# Altium project Advanced Active Tone Control.PrjPcb
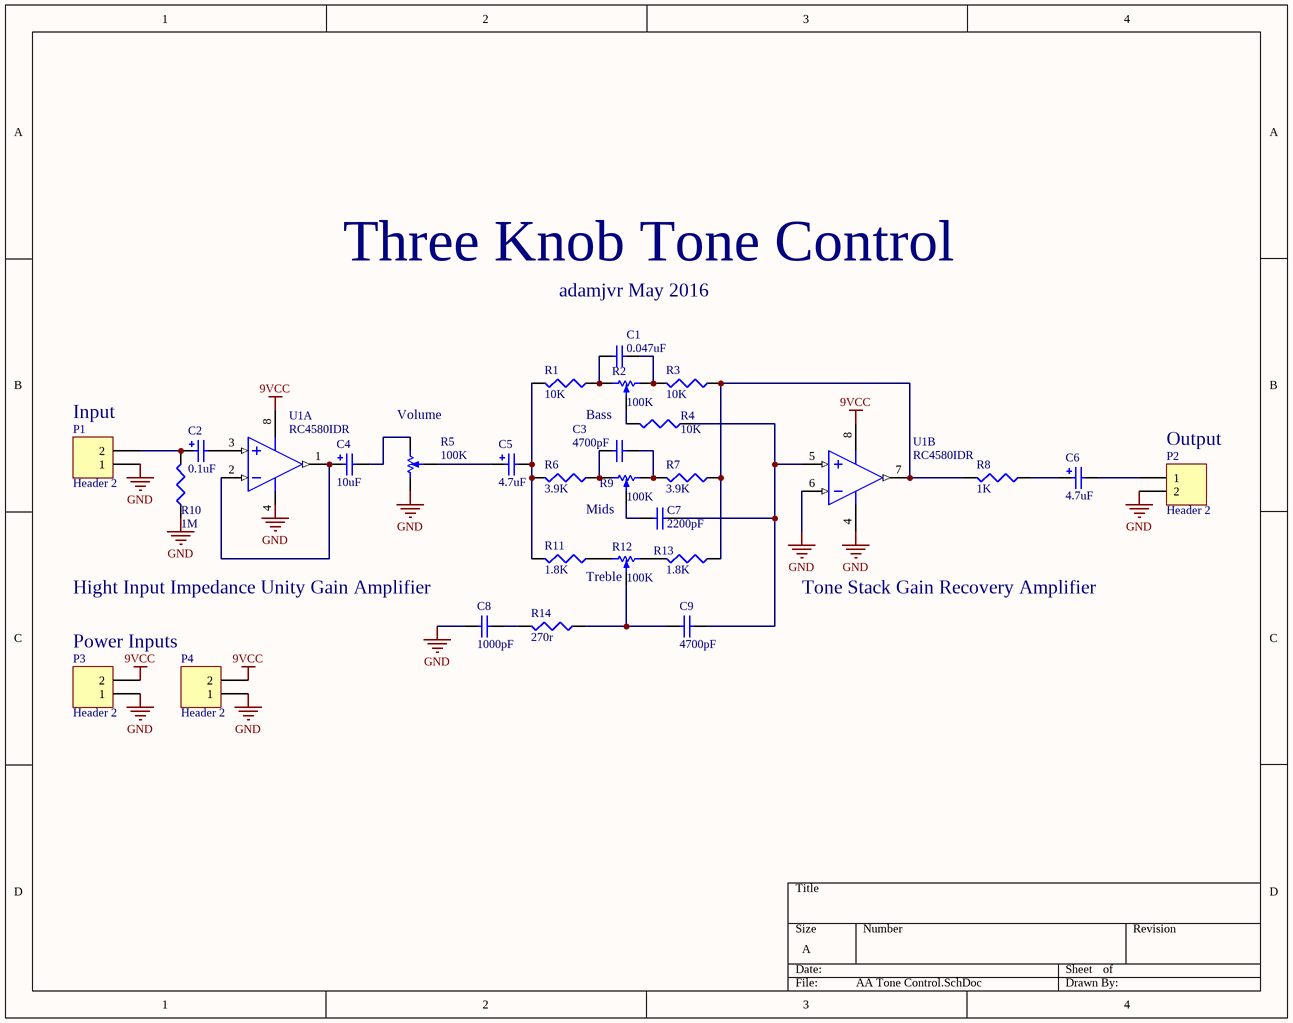
[diagram p0: AA Tone Control.SchDoc]
1 sheet, 28 parts. Net scope: global (net labels, ports and power ports of the same name join across sheets).
Board file: AA Tone Control.PcbDoc

## Sheet AA Tone Control.SchDoc
size A

### Parts
C1  0.047uF  [K473K15X7RF5TH5]
C2  0.1uF  [4X6mmCAP]
C3  4700pF  [VY2472M49Y5US63V7]
C4  10uF  [5X12.5mmCAP - GREEN]
C5  4.7uF  [4X6mmCAP]
C6  4.7uF  [4X6mmCAP]
C7  2200pF  [VY1222M47Y5UQ63V0]
C8  1000pF  [VY2102M29Y5US63V7]
C9  4700pF  [VY2472M49Y5US63V7]
P1  Header 2  [HDR1X2]
P2  Header 2  [HDR1X2]
P3  Header 2  [HDR1X2]
P4  Header 2  [HDR1X2]
R1  10K  [R0805]
R2  100K  [BOURNS_PTD90SERIES_POT]
R3  10K  [R0805]
R4  10K  [R0805]
R5  100K  [BOURNS_PTD90SERIES_POT]
R6  3.9K  [R0805]
R7  3.9K  [R0805]
R8  1K  [R0805]
R9  100K  [BOURNS_PTD90SERIES_POT]
R10  1M  [R0805]
R11  1.8K  [R0805]
R12  100K  [BOURNS_PTD90SERIES_POT]
R13  1.8K  [R0805]
R14  270r  [R0805]
U1  RC4580IDR  [SOIC127P600X175-8N]  (parts A,B of 2)

### Nets
9VCC: P3.2 P4.2 U1.8(V+)
GND: C8.2 P1.1 P2.2 P3.1 P4.1 R5.3 R10.1 U1.4(V-) U1.6(IN_B)
NetC1_1: C1.1 R2.1 R3.2
NetC1_2: C1.2 R1.1 R2.3
NetC2_1: C2.1 P1.2 R10.2
NetC2_2: C2.2 U1.3(IN_A)
NetC3_1: C3.1 R7.2 R9.1
NetC3_2: C3.2 R6.1 R9.3
NetC4_1: C4.1 U1.1(OUT_A) U1.2(IN_A)
NetC4_2: C4.2 R5.1
NetC5_1: C5.1 R5.2
NetC5_2: C5.2 R1.2 R6.2 R11.2
NetC6_1: C6.1 R8.1
NetC6_2: C6.2 P2.1
NetC7_1: C7.1 C9.1 R4.1 U1.5(IN_B)
NetC7_2: C7.2 R9.2
NetC8_1: C8.1 R14.2
NetC9_2: C9.2 R12.2 R14.1
NetR2_2: R2.2 R4.2
NetR3_1: R3.1 R7.1 R8.2 R13.1 U1.7(OUT_B)
NetR11_1: R11.1 R12.3
NetR12_1: R12.1 R13.2

### Notes on the sheet
- Three Knob Tone Control
- adamjvr May 2016
- (near P1) Input
- (near R5) Volume
- (near R2) Bass
- (near P2) Output
- (near R9) Mids
- (near C8) Hight Input Impedance Unity Gain Amplifier
- (near R12) Treble
- Tone Stack Gain Recovery Amplifier
- Power Inputs
- Labels drawn without touching a wire or pin: GND

### Library data of the parts
C1 = K473K15X7RF5TH5: 0.047µF ±10% 50V X7R Ceramic Capacitor -55°C ~ 125°C Through Hole Radial 0.157" L x 0.098" W (4.00mm x 2.50mm); MFR: Vishay BC Components; Pin Count #: 2; Type: Ceramic dipped Capacitor K series 5mm lead spacing; Lead-Free ?: Yes; Designer: Adam Vadala-Roth; MFR #: K473K15X7RF5TH5; Status: Active; Mounting: Through Hole; Datasheet: http://www.vishay.com/docs/45171/kseries.pdf; Height: 6.54mm; Tolerance: 10%; Cost: 0.04692 @ 1000; Voltage: 50V; Date Created: 11 May 2016; Last Modified: 11 May 2016; Value: 0.047uF
C2 = UMW1H0R1MDD1TP: CAP ALUM 0.1UF 20% 50V RADIAL; MFR: Nichion; Pin Count #: 2; Type: Aluminum Capacitor; Lead-Free ?: Yes; Designer: Adam Vadala-Roth; MFR #: UMW1H0R1MDD1TP; Status: Active; Mounting: Through Hole; Datasheet: http://nichicon-us.com/english/products/pdfs/e-umw.pdf; Height: 6mm; Tolerance: 20%; Cost: 0.08766 @ 1000; Voltage: 50V; Date Created: 10 May 2016; Last Modified: 10 May 2016; Value: 0.1uF
C3 C9 = VY2472M49Y5US63V7: 4700pF ±20% 440VAC Y5U (E) Ceramic Capacitor -40°C ~ 125°C Through Hole Radial, Disc 0.492" Dia (12.50mm); MFR: Vishay-BC-Components; Pin Count #: 2; Type: Ceramic Capacitor Throughole Disc; Lead-Free ?: Yes; Designer: Adam Vadala-Roth; MFR #: VY2472M49Y5US63V7; Status: Active; Mounting: SMT/SMD; Datasheet: http://www.vishay.com/docs/28535/vy2series.pdf; Height: 16.5mm; Tolerance: 20%; Cost: 0.10697 @ 1000; Voltage: 440VAC; Date Created: 10 May 2016; Last Modified: 10 May 2016; Value: 4700pF; Digikey #: BC2359-ND
C4 = UES1E100MDM1TD: CAP ALUM 10UF 20% 25V RADIAL; MFR: Nichicon; Pin Count #: 2; Type: Aluminum Capacitor; Lead-Free ?: Yes; Designer: Adam Vadala-Roth; MFR #: UES1E100MDM1TD; Status: Active; Mounting: SMT/SMD; Datasheet: http://nichicon-us.com/english/products/pdfs/e-ues.pdf; Height: 12.5mm; Tolerance: 20%; Cost: 0.16785 @ 1000; Voltage: 25V; Date Created: 10 May 2016; Last Modified: 10 May 2016; Value: 10uF
C5 C6 = UMW1V4R7MDD1TP: CAP ALUM 4.7UF 20% 35V RADIAL; MFR: Nichicon; Pin Count #: 2; Type: Aluminum Capacitor RAdial throughole; Lead-Free ?: Yes; Designer: Adam Vadala-Roth; MFR #: UMW1V4R7MDD1TP; Status: Active; Mounting: Through Hole; Datasheet: http://nichicon-us.com/english/products/pdfs/e-umw.pdf; Height: 6mm; Tolerance: 20%; Cost: 0.08766 @ 1000; Voltage: 35V; Date Created: 10 May 2016; Last Modified: 10 May 2016; Value: 4.7uF
C7 = VY1222M47Y5UQ63V0: 2200pF ±20% 760VAC Y5U (E) Ceramic Capacitor -40°C ~ 125°C Through Hole Radial, Disc 0.472" Dia (12.00mm); MFR: Vishay-BC-Components; Pin Count #: 2; Type: Ceramic Cap Throughhole Disc; Lead-Free ?: Yes; Designer: Adam Vadala-Roth; MFR #: VY1222M47Y5UQ63V0; Status: Active; Mounting: Throughhole; Datasheet: http://www.vishay.com/docs/28537/vy1series.pdf; Height: 10mm; Tolerance: 20%; Cost: 0.11985	@ 1000; Voltage: 760VAC; Date Created: 11 May 2016; Last Modified: 11 May 2016; Value: 2200pF
C8 = VY2102M29Y5US63V7: 1000pF ±20% 440VAC Y5U (E) Ceramic Capacitor -40°C ~ 125°C Through Hole Radial, Disc 0.295" Dia (7.50mm); MFR: Vishay-BC-Components; Pin Count #: 2; Type: Ceramic Capacitor Disc Throughhole; Lead-Free ?: Yes; Designer: Adam Vadala-Roth; Dgikey #: BC2354-ND; MFR #: VY2102M29Y5US63V7; Status: Active; Mounting: SMT/SMD; Datasheet: http://www.vishay.com/docs/28535/vy2series.pdf; Height: 11.5mm; Tolerance: 20%; Cost: 0.07182; Voltage: 440VAC; Date Created: 10 May 2016; Last Modified: 10 May 2016; Value: 1000pF
P1-P4 = Header 2: Header, 2-Pin; LatestRevisionDate: 17-Jul-2002; LatestRevisionNote: Re-released for DXP Platform.; Publisher: Altium Limited
R1 R3 R4 = ERJ-6ENF1002V: RES SMD 10K OHM 1% 1/8W 0805; MFR: Panasonic-Electronic-Components; Pin Count #: 2; Lead-Free ?: Yes; Designer: Adam Vadala-Roth; MFR #: ERJ-6ENF1002V; Status: Active; Mounting: SMT/SMD; Datasheet: http://industrial.panasonic.com/www-cgi/jvcr13pz.cgi?E+PZ+3+AOA0002+ERJ6ENF1002V+7+WW; Height: 0.7mm; Tolerance: 1%; Cost: 0.00729 @ 1000; Type: Chip Resistor 0805; Voltage: 1/8W; Date Created: 8 May 2016; Last Modified: 8 May 2016; Value: 10K
R2 R5 R9 R12 = PTD901-2015K-B104: POT 100K OHM 1/20W CARBON LINEAR; MFR: Bourns Inc.; Pin Count #: 3; Tolerance: 20%; Lead-Free ?: Yes; Designer: Adam Vadala-Roth; MFR #: PTD901-2015K-B104; Status: Active; Mounting: Through Hole; Datasheet: http://www.bourns.com/docs/Product-Datasheets/PTD90.pdf; Height: 11mm; Cost: 0.91800	 @ 1000; Type: Throughhole Potentiometer; Voltage: 1/20W; Date Created: 10 May 2016; Last Modified: 10 May 2016; Value: 100K
R6 R7 = RC2012F392CS: RES SMD 3.9K OHM 1% 1/8W 0805; MFR: Samsung-Electro-Mechanics-America,-Inc.; Pin Count #: 2; Lead-Free ?: Yes; Designer: Adam Vadala-Roth; MFR #: RC2012F392CS; Status: Active; Mounting: SMT/SMD; Datasheet: https://media.digikey.com/pdf/Data%20Sheets/Samsung%20PDFs/RC_Series_ds.pdf; Height: 0.6mm; Tolerance: 1%; Cost: 0.00408 @ 1000; Type: Chip Resistor 0805; Voltage: 1/8W; Date Created: 10 May 2016; Last Modified: 10 May 2016; Value: 3.9K
R8 = RC2012F102CS: RES SMD 1K OHM 1% 1/8W 0805; MFR: Samsung-Electro-Mechanics-America,-Inc.; Pin Count #: 2; Lead-Free ?: Yes; Designer: Adam Vadala-Roth; MFR #: RC2012F102CS; Status: Active; Mounting: SMT/SMD; Datasheet: https://media.digikey.com/pdf/Data%20Sheets/Samsung%20PDFs/RC_Series_ds.pdf; Height: 0.6mm; Tolerance: 1%; Cost: 0.00408	 @ 1000; Type: Chip Resistor; Voltage: 1/8W; Date Created: 10 May 2016; Last Modified: 10 May 2016; Value: 1K
R10 = RC2012J105CS: RES SMD 1M OHM 5% 1/8W 0805; MFR: Samsung-Electro-Mechanics-America,-Inc.; Pin Count #: 2; Lead-Free ?: Yes; Designer: Adam Vadala-Roth; MFR #: RC2012J105CS; Status: Active; Mounting: SMT/SMD; Datasheet: https://media.digikey.com/pdf/Data%20Sheets/Samsung%20PDFs/RC_Series_ds.pdf; Height: 0.60mm; Tolerance: 5%; Cost: 0.00379	 @ 1000; Type: Chip Resistor 0805; Voltage: 1/8W; Date Created: 10 May 2016; Last Modified: 10 May 2016; Value: 1M
R11 R13 = RC2012F182CS: RES SMD 1.8K OHM 1% 1/8W 0805; MFR: Samsung-Electro-Mechanics-America,-Inc.; Pin Count #: 2; Lead-Free ?: Yes; Designer: Adam Vadala-Roth; MFR #: RC2012F182CS; Status: Active; Mounting: SMT/SMD; Datasheet: https://media.digikey.com/pdf/Data%20Sheets/Samsung%20PDFs/RC_Series_ds.pdf; Height: 0.60mm; Tolerance: 1%; Cost: 0.00408 @ 1000; Type: Chip Resistor 0805; Voltage: 1/8W; Date Created: 10 May 2016; Last Modified: 10 May 2016; Value: 1.8K
R14 = RC2012F271CS: RES SMD 270 OHM 1% 1/8W 0805; MFR: Samsung-Electro-Mechanics-America,-Inc.; Pin Count #: 2; Lead-Free ?: Yes; Designer: Adam Vadala-Roth; MFR #: RC2012F271CS; Status: Active; Mounting: SMT/SMD; Datasheet: https://media.digikey.com/pdf/Data%20Sheets/Samsung%20PDFs/RC_Series_ds.pdf; Height: 0.60mm; Tolerance: 1%; Cost: 0.00408 @ 1000; Type: Chip Resistor 0805; Voltage: 1/8W; Date Created: 10 May 2016; Last Modified: 10 May 2016; Value: 270r
U1 = RC4580IDR: IC OPAMP AUDIO 12MHZ 8SOIC Low Noise, High Performance, High Fidelity Dual Audio Operational Amplifier, 8-pin Narrow SOIC; MFR: Texas Instruments; Pin Count #: 8; Lead-Free ?: Yes; Voltage: 16V Max; Designer: Adam Vadala-Roth; MFR #: RC4580IDR; Status: Active; Mounting: SMT/SMD; Datasheet: http://www.ti.com/lit/ds/symlink/rc4580.pdf; Height: 1.2mm; Tolerance: N/A; Cost: 0.35000 @ 2500; Type: OPAMP IC, SOIC8 Package; Date Created: 10 May 2016; Last Modified: 10 May 2016